# Altium schematic sheet Power-5V-Panel.SchDoc: Power +5V Panel
size A3; Organization: Hofmann Travel; SheetNumber: 9; SheetTotal: 10
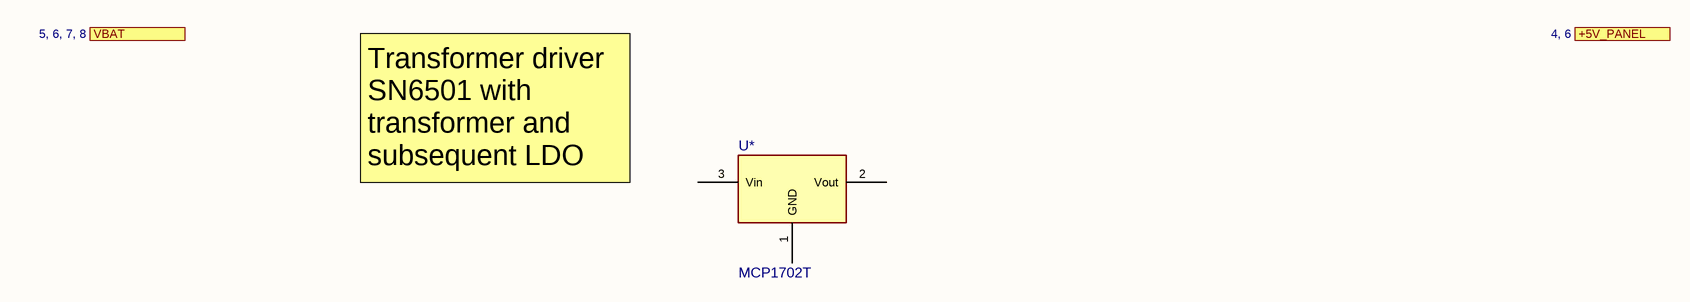
[diagram p0: Power-5V-Panel.SchDoc]

## Parts
U*  MCP1702T  [SOT2395P280X125-3-SE]

## Ports
+5V_PANEL (out, see 4, 6), VBAT (in, see 5, 6, 7, 8)

## Nets

Not connected (* = marked no-connect by the designer): U* 1(GND) 2(Vout) 3(Vin)

## Notes on the sheet
- Transformer driver SN6501 with transformer and subsequent LDO
- Date:
- Size:
- A3
- Schema:
- Layout:

## Library data of the parts
U* = MCP1702T-4002E/CB: Linear Voltage Regulator IC Positive Fixed 1 Output 250mA SOT-23A-3; Manufacturer: Microchip Technology; Manufacturer 1: Microchip; Part Number: MCP1702T-4002E/CB; Package: SOT23; HelpURL: https://ww1.microchip.com/downloads/en/DeviceDoc/22008E.pdf; Manufacturer Part Number 1: MCP1702T-4002E/CB; Supplier 1: Digi-Key; Supplier Part Number 1: MCP1702T-4002E/CBCT-ND; Manufacturer 3: Microne; Manufacturer Part Number 3: ME6209A40M3G; Supplier 3: LCSC; Supplier Part Number 3: C83509